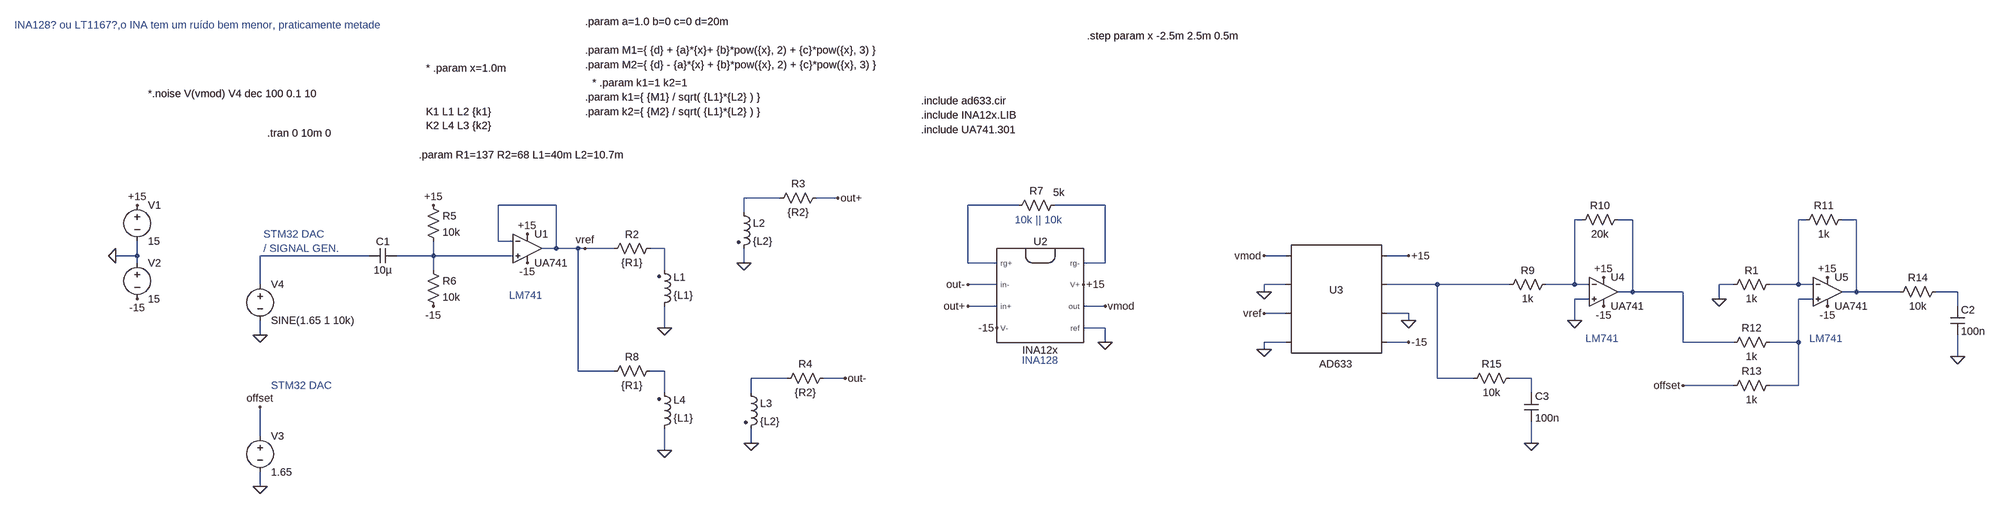
[diagram p0: schematic sim1.asc]
sim1.asc, the LTspice schematic file:
Version 4
SHEET 1 2580 680
WIRE -96 -48 -176 -48
WIRE 32 -48 -16 -48
WIRE -592 -32 -720 -32
WIRE 432 -32 320 -32
WIRE 624 -32 512 -32
WIRE -176 -16 -176 -48
WIRE 1680 0 1664 0
WIRE 1792 0 1760 0
WIRE 2176 0 2160 0
WIRE 2288 0 2256 0
WIRE -720 48 -720 -32
WIRE -688 48 -720 48
WIRE -592 64 -592 -32
WIRE -592 64 -624 64
WIRE -544 64 -592 64
WIRE -528 64 -544 64
WIRE -464 64 -528 64
WIRE -352 64 -384 64
WIRE -1520 80 -1520 48
WIRE -1520 80 -1568 80
WIRE -1008 80 -1248 80
WIRE -864 80 -864 48
WIRE -864 80 -944 80
WIRE -688 80 -864 80
WIRE 1024 80 976 80
WIRE 1296 80 1248 80
WIRE -1520 96 -1520 80
WIRE -176 96 -176 64
WIRE 320 96 320 -32
WIRE 384 96 320 96
WIRE 624 96 624 -32
WIRE 624 96 576 96
WIRE -864 112 -864 80
WIRE -352 112 -352 64
WIRE -1248 144 -1248 80
WIRE 384 144 320 144
WIRE 1024 144 976 144
WIRE 1360 144 1248 144
WIRE 1520 144 1360 144
WIRE 1664 144 1664 0
WIRE 1664 144 1600 144
WIRE 1696 144 1664 144
WIRE 2016 144 1984 144
WIRE 2160 144 2160 0
WIRE 2160 144 2096 144
WIRE 2192 144 2160 144
WIRE 976 160 976 144
WIRE 1792 160 1792 0
WIRE 1792 160 1760 160
WIRE 1904 160 1792 160
WIRE 2288 160 2288 0
WIRE 2288 160 2256 160
WIRE 2384 160 2288 160
WIRE 2512 160 2464 160
WIRE 1696 176 1664 176
WIRE 1984 176 1984 144
WIRE 2192 176 2160 176
WIRE 384 192 320 192
WIRE 624 192 576 192
WIRE 2512 192 2512 160
WIRE 1024 208 976 208
WIRE 1296 208 1248 208
WIRE 1296 224 1296 208
WIRE 1664 224 1664 176
WIRE -352 240 -352 192
WIRE 624 240 576 240
WIRE -1248 256 -1248 224
WIRE 624 272 624 240
WIRE 1024 272 976 272
WIRE 1296 272 1248 272
WIRE 1904 272 1904 160
WIRE 2016 272 1904 272
WIRE 2160 272 2160 176
WIRE 2160 272 2096 272
WIRE 976 288 976 272
WIRE 2512 304 2512 256
WIRE -544 336 -544 64
WIRE -464 336 -544 336
WIRE -352 336 -384 336
WIRE -80 352 -160 352
WIRE 48 352 0 352
WIRE 1360 352 1360 144
WIRE 1440 352 1360 352
WIRE 1568 352 1520 352
WIRE 2016 368 1904 368
WIRE 2160 368 2160 272
WIRE 2160 368 2096 368
WIRE -352 384 -352 336
WIRE -160 384 -160 352
WIRE 1568 384 1568 352
WIRE -1248 480 -1248 416
WIRE -160 496 -160 464
WIRE 1568 496 1568 448
WIRE -352 512 -352 464
WIRE -1248 592 -1248 560
FLAG -1568 80 0
FLAG -1520 -32 +15
FLAG -1520 176 -15
FLAG 624 272 0
FLAG 576 144 +15
FLAG 384 240 -15
FLAG -1248 256 0
FLAG -656 32 +15
FLAG -656 96 -15
FLAG -352 240 0
FLAG -160 496 0
FLAG -176 96 0
FLAG 32 -48 out+
FLAG 48 352 out-
FLAG 320 192 out+
FLAG 320 144 out-
FLAG -864 -32 +15
FLAG -864 192 -15
FLAG -528 64 vref
FLAG 624 192 vmod
FLAG 976 288 0
FLAG 976 160 0
FLAG 1296 224 0
FLAG 1296 80 +15
FLAG 1296 272 -15
FLAG 976 80 vmod
FLAG 976 208 vref
FLAG -352 512 0
FLAG 1728 128 +15
FLAG 1728 192 -15
FLAG 1664 224 0
FLAG -1248 592 0
FLAG -1248 416 offset
FLAG 2224 128 +15
FLAG 2224 192 -15
FLAG 1984 176 0
FLAG 1904 368 offset
FLAG 2512 304 0
FLAG 1568 496 0
SYMBOL voltage -1520 -48 R0
WINDOW 123 0 0 Left 0
WINDOW 39 0 0 Left 0
SYMATTR InstName V1
SYMATTR Value 15
SYMBOL voltage -1520 80 R0
WINDOW 123 0 0 Left 0
WINDOW 39 0 0 Left 0
SYMATTR InstName V2
SYMATTR Value 15
SYMBOL INA128 480 192 R0
SYMATTR InstName U2
SYMATTR Value INA12x
SYMBOL voltage -1248 128 R0
WINDOW 123 0 0 Left 0
WINDOW 39 0 0 Left 0
SYMATTR InstName V4
SYMATTR Value SINE(1.65 1 10k)
SYMBOL ind2 -368 208 M180
WINDOW 0 36 80 Left 2
WINDOW 3 36 40 Left 2
SYMATTR InstName L1
SYMATTR Value {L1}
SYMATTR Type ind
SYMBOL res -368 48 R90
WINDOW 0 0 56 VBottom 2
WINDOW 3 32 56 VTop 2
SYMATTR InstName R2
SYMATTR Value {R1}
SYMBOL OpAmps\\opamp2 -656 0 R0
SYMATTR InstName U1
SYMATTR Value UA741
SYMBOL ind2 -192 -32 R0
SYMATTR InstName L2
SYMATTR Value {L2}
SYMATTR Type ind
SYMBOL ind2 -176 368 R0
SYMATTR InstName L3
SYMATTR Value {L2}
SYMATTR Type ind
SYMBOL res 0 -64 R90
WINDOW 0 0 56 VBottom 2
WINDOW 3 32 56 VTop 2
SYMATTR InstName R3
SYMATTR Value {R2}
SYMBOL res 16 336 R90
WINDOW 0 0 56 VBottom 2
WINDOW 3 32 56 VTop 2
SYMATTR InstName R4
SYMATTR Value {R2}
SYMBOL cap -944 64 R90
WINDOW 0 0 32 VBottom 2
WINDOW 3 32 32 VTop 2
SYMATTR InstName C1
SYMATTR Value 10µ
SYMBOL res -880 -48 R0
SYMATTR InstName R5
SYMATTR Value 10k
SYMBOL res -880 96 R0
SYMATTR InstName R6
SYMATTR Value 10k
SYMBOL res 528 -48 R90
WINDOW 0 0 56 VBottom 2
WINDOW 3 -28 6 VTop 2
SYMATTR InstName R7
SYMATTR Value 5k
SYMBOL Misc\\DIP8 1136 176 R0
WINDOW 3 -1 144 Center 2
SYMATTR InstName U3
SYMATTR Value AD633
SYMBOL ind2 -368 480 M180
WINDOW 0 36 80 Left 2
WINDOW 3 36 40 Left 2
SYMATTR InstName L4
SYMATTR Value {L1}
SYMATTR Type ind
SYMBOL res -368 320 R90
WINDOW 0 0 56 VBottom 2
WINDOW 3 32 56 VTop 2
SYMATTR InstName R8
SYMATTR Value {R1}
SYMBOL OpAmps\\opamp2 1728 96 R0
SYMATTR InstName U4
SYMATTR Value UA741
SYMBOL res 1616 128 R90
WINDOW 0 0 56 VBottom 2
WINDOW 3 32 56 VTop 2
SYMATTR InstName R9
SYMATTR Value 1k
SYMBOL res 1776 -16 R90
WINDOW 0 0 56 VBottom 2
WINDOW 3 32 56 VTop 2
SYMATTR InstName R10
SYMATTR Value 20k
SYMBOL voltage -1248 464 R0
WINDOW 123 0 0 Left 0
WINDOW 39 0 0 Left 0
SYMATTR InstName V3
SYMATTR Value 1.65
SYMBOL OpAmps\\opamp2 2224 96 R0
SYMATTR InstName U5
SYMATTR Value UA741
SYMBOL res 2112 128 R90
WINDOW 0 0 56 VBottom 2
WINDOW 3 32 56 VTop 2
SYMATTR InstName R1
SYMATTR Value 1k
SYMBOL res 2272 -16 R90
WINDOW 0 0 56 VBottom 2
WINDOW 3 32 56 VTop 2
SYMATTR InstName R11
SYMATTR Value 1k
SYMBOL res 2112 256 R90
WINDOW 0 0 56 VBottom 2
WINDOW 3 32 56 VTop 2
SYMATTR InstName R12
SYMATTR Value 1k
SYMBOL res 2112 352 R90
WINDOW 0 0 56 VBottom 2
WINDOW 3 32 56 VTop 2
SYMATTR InstName R13
SYMATTR Value 1k
SYMBOL res 2480 144 R90
WINDOW 0 0 56 VBottom 2
WINDOW 3 32 56 VTop 2
SYMATTR InstName R14
SYMATTR Value 10k
SYMBOL cap 2496 192 R0
SYMATTR InstName C2
SYMATTR Value 100n
SYMBOL res 1536 336 R90
WINDOW 0 0 56 VBottom 2
WINDOW 3 32 56 VTop 2
SYMATTR InstName R15
SYMATTR Value 10k
SYMBOL cap 1552 384 R0
SYMATTR InstName C3
SYMATTR Value 100n
TEXT -1232 -192 Left 2 !.tran 0 10m 0
TEXT 216 -232 Left 2 !.include INA12x.LIB
TEXT -896 -144 Left 2 !.param R1=137 R2=68 L1=40m L2=10.7m
TEXT 440 312 Left 2 ;INA128
TEXT 216 -200 Left 2 !.include UA741.301
TEXT -1240 32 Left 2 ;STM32 DAC
TEXT -1240 64 Left 2 ;/ SIGNAL GEN.
TEXT -696 168 Left 2 ;LM741
TEXT -880 -240 Left 2 !K1 L1 L2 {k1}\nK2 L4 L3 {k2}
TEXT -528 -272 Left 2 !.param k1={ {M1} / sqrt( {L1}*{L2} ) }
TEXT -528 -240 Left 2 !.param k2={ {M2} / sqrt( {L1}*{L2} ) }
TEXT -512 -304 Left 2 !* .param k1=1 k2=1
TEXT 424 0 Left 2 ;10k || 10k
TEXT -880 -336 Left 2 !* .param x=1.0m
TEXT -528 -376 Left 2 !.param M1={ {d} + {a}*{x}+ {b}*pow({x}, 2) + {c}*pow({x}, 3) }
TEXT -528 -440 Left 2 !.param a=1.0 b=0 c=0 d=20m
TEXT -528 -344 Left 2 !.param M2={ {d} - {a}*{x} + {b}*pow({x}, 2) + {c}*pow({x}, 3) }
TEXT -1792 -432 Left 2 ;INA128? ou LT1167?,o INA tem um ruído bem menor, praticamente metade
TEXT -1496 -280 Left 2 !*.noise V(vmod) V4 dec 100 0.1 10
TEXT 584 -408 Left 2 !.step param x -2.5m 2.5m 0.5m
TEXT 216 -264 Left 2 !.include ad633.cir
TEXT 1688 264 Left 2 ;LM741
TEXT -1224 368 Left 2 ;STM32 DAC
TEXT 2184 264 Left 2 ;LM741

The netlist it stands for:
* sim1.asc
V1 +15 0 15
V2 0 -15 15
XU2 out+ out- +15 -15 vmod 0 N003 N002 INA12x  ; pins in+ in- V+ V- out ref rg- rg+
V4 N009 0 SINE(1.65 1 10k)
L1 0 N008 {L1}
R2 N008 vref {R1}
XU1 N010 vref +15 -15 vref UA741  ; pins In+ In- V+ V- OUT
L2 N001 0 {L2}
L3 N015 0 {L2}
R3 out+ N001 {R2}
R4 out- N015 {R2}
C1 N010 N009 10µ
R5 +15 N010 10k
R6 N010 -15 10k
R7 N003 N002 5k
XU3 vmod 0 vref 0 -15 0 N011 +15 AD633
L4 0 N014 {L1}
R8 N014 vref {R1}
XU4 0 N004 +15 -15 N005 UA741  ; pins In+ In- V+ V- OUT
R9 N004 N011 1k
R10 N005 N004 20k
V3 offset 0 1.65
XU5 N013 N006 +15 -15 N007 UA741  ; pins In+ In- V+ V- OUT
R1 N006 0 1k
R11 N007 N006 1k
R12 N013 N005 1k
R13 N013 offset 1k
R14 N012 N007 10k
C2 N012 0 100n
R15 N016 N011 10k
C3 N016 0 100n
.tran 0 10m 0
.include INA12x.LIB
.param R1=137 R2=68 L1=40m L2=10.7m
* INA128
.include UA741.301
* STM32 DAC
* / SIGNAL GEN.
* LM741
K1 L1 L2 {k1}
K2 L4 L3 {k2}
.param k1={ {M1} / sqrt( {L1}*{L2} ) }
.param k2={ {M2} / sqrt( {L1}*{L2} ) }
* .param k1=1 k2=1
* 10k || 10k
* .param x=1.0m
.param M1={ {d} + {a}*{x}+ {b}*pow({x}, 2) + {c}*pow({x}, 3) }
.param a=1.0 b=0 c=0 d=20m
.param M2={ {d} - {a}*{x} + {b}*pow({x}, 2) + {c}*pow({x}, 3) }
* INA128? ou LT1167?,o INA tem um ruído bem menor, praticamente metade
*.noise V(vmod) V4 dec 100 0.1 10
.step param x -2.5m 2.5m 0.5m
.include ad633.cir
* LM741
* STM32 DAC
* LM741
.lib C:\users\gosmann\Documents\EBE\EBE_LVDT_project\simulations\INA12x.LIB
.backanno
.end